# EAGLE design Encoder board Trim#1 (EAGLE 6.5.0)
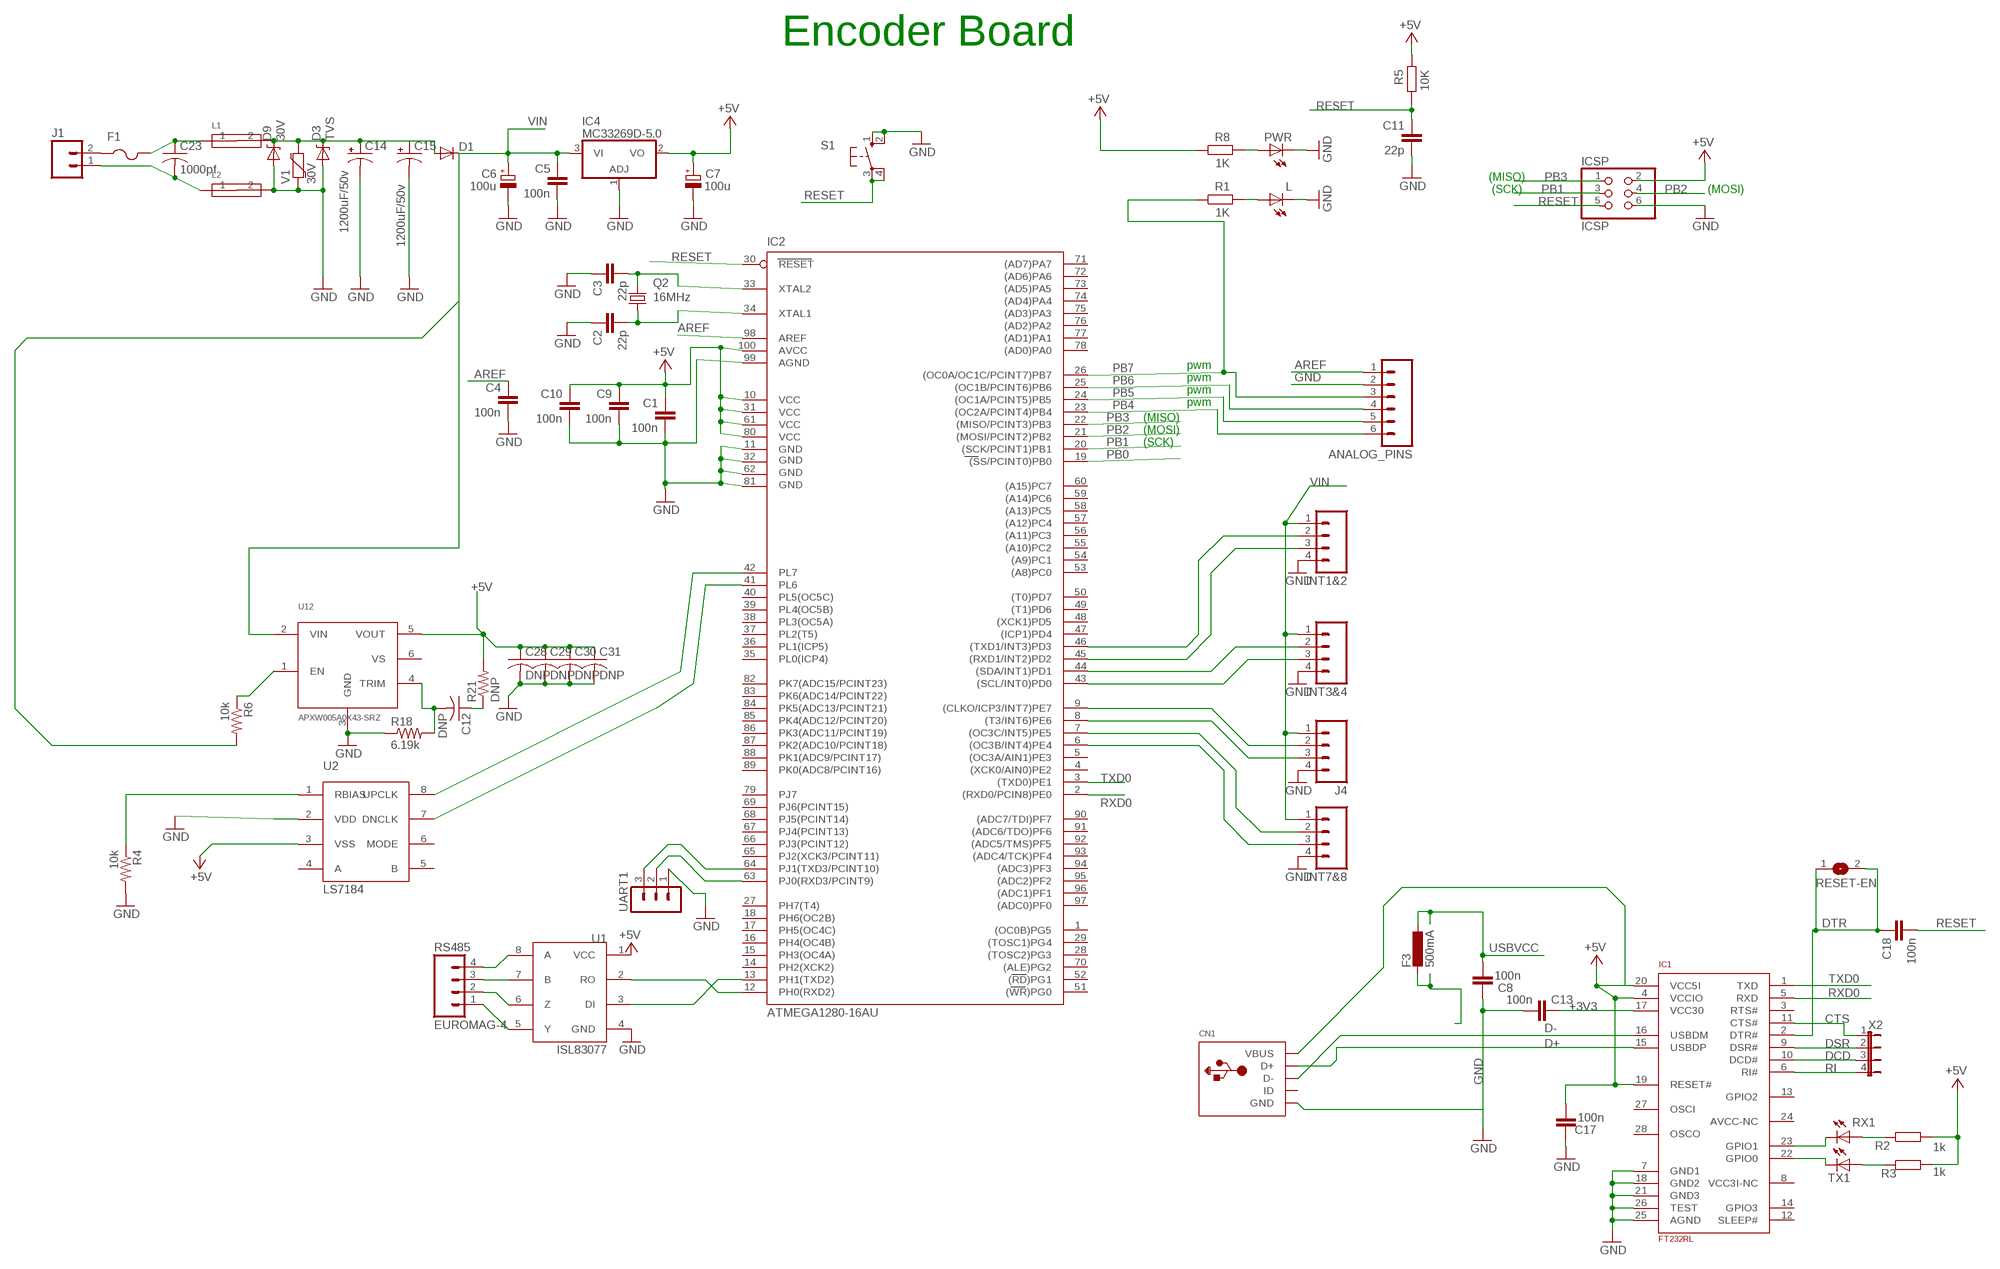
[diagram p0: schematic, sheet 1]

## Parts
ANALOG_PINS  M06  [06P]
C1  100n  C-EU  [C0805RND]
C2  22p  C-EU  [C0805RND]
C3  22p  C-EU  [C0805RND]
C4  100n  C-EU  [C0805RND]
C5  100n  C-EU  [C0805RND]
C6  100u  CPOL-EUSMCD  [SMC_D]
C7  100u  CPOL-EUSMCD  [SMC_D]
C8  100n  C-EU  [C0805RND]
C9  100n  C-EU  [C0805RND]
C10  100n  C-EU  [C0805RND]
C11  22p  C-EU  [C0805RND]
C12  DNP  C-USC0805  [C0805]
C13  100n  C-EU  [C0805RND]
C14  1200uF/50v  CAP_CAN1  [CAN_18MM]
C15  1200uF/50v  CAP_CAN1  [CAN_18MM]
C17  100n  C-EU  [C0805RND]
C18  100n  C-EU  [C0805RND]
C23  1000pf  C-USC1825  [C1825]
C28  DNP  C-USC0805  [C0805]
C29  DNP  C-USC0805  [C0805]
C30  DNP  C-USC0805  [C0805]
C31  DNP  C-USC0805  [C0805]
CN1  USBMINIB  [USB-MINIB]
D1  DIODE-SMB  [SMB]
D3  TVS  [DO-214AC]
D9  30V  DIODE-ZENERSMB  [SMB-DIODE]
F1  PTCFUSE-1206  [R1206]
F3  500mA  L-EUL1812  [L1812]
IC1  FT232RL  [SSOP28]
IC2  ATMEGA1280-16AU  [TQFP100]
IC4  MC33269D-5.0  [DPACK]
ICSP  ICSP  PINHD-2X3  [2X03]
INT1&2  EUROMAG-4  [M4]
INT3&4  EUROMAG-4UP  [M4-90]
INT7&8  EUROMAG-4UP  [M4-90]
J1  EUROMAG-290DEG  [M2]
J4  EUROMAG-4  [M4]
L  LED0805ROUND  [0805RND]
L1  FERITEBEAD  [0603]
L2  FERITEBEAD  [0603]
PWR  LED0805ROUND  [0805RND]
Q2  16MHz  CRYTALHC49S  [HC49/S]
R1  1K  R-EU_  [R0805RND]
R2  1k  R-EU_  [R0805RND]
R3  1k  R-EU_  [R0805RND]
R4  10k  R-US_R0805  [R0805]
R5  10K  R-EU_  [R0805RND]
R6  10k  R-US_R0805  [R0805]
R8  1K  R-EU_  [R0805RND]
R18  6.19k  R-US_R0805  [R0805]
R21  DNP  R-US_R0805  [R0805]
RESET-EN  SJ  [SJ]
RS485  EUROMAG-4  [M4]
RX1  LED0805ROUND  [0805RND]
S1  10-XX  [B3F-10XX]
TX1  LED0805ROUND  [0805RND]
U1  ISL83077  [SO08]
U2  LS7184  [SO08]
U12  APXW005A0X43-SRZ  [APXW005A0X43-SRZ]
UART1  MA03-1  [MA03-1]
V1  30V  VARISTOR-0603  [0603-RES]
X2  JP4E  [JP4]

## Nets
+3V3 [power]: C13.2 IC1.17(VCC30)
+5V [usbvcc]: C1.1 C7.+ C9.1 C10.1 C17.1 C28.1 C29.1 C30.1 C31.1 CN1.VBUS IC1.4(VCCIO) IC1.19(RESET#) IC1.20(VCC5I) IC2.10(VCC) IC2.31(VCC1) IC2.61(VCC2) IC2.80(VCC3) IC2.100(AVCC) IC4.2(VO) ICSP.2 R2.2 R3.2 R5.2 R8.1 R21.2 U1.1(VCC) U2.3(VSS) U12.5(VOUT)
AREF: ANALOG_PINS.1 C4.1 IC2.98(AREF)
CTS: IC1.11(CTS#) X2.1
D+: IC1.15(USBDP)
D-: CN1.D- IC1.16(USBDM)
DCD: IC1.10(DCD#) X2.3
DSR: IC1.9(DSR#) X2.2
DTR: C18.1 IC1.2(DTR#) RESET-EN.1 RESET-EN.2
GND [gnd]: ANALOG_PINS.2 C1.2 C2.1 C3.1 C4.2 C5.2 C6.- C7.- C8.2 C9.2 C10.2 C11.2 C13.1 C14.- C15.- C17.2 C28.2 C29.2 C30.2 C31.2 CN1.GND D3.A D9.A IC1.7(GND1) IC1.18(GND2) IC1.21(GND3) IC1.25(AGND) IC1.26(TEST) IC2.11(GND) IC2.32(GND1) IC2.62(GND2) IC2.81(GND3) IC2.99(AGND) IC4.1(ADJ) ICSP.6 INT1&2.4 INT3&4.4 INT7&8.4 J4.4 L2.2 L.P$2(C) PWR.P$2(C) R4.2 R18.1 S1.1(S) S1.2(S1) U1.4(GND) U2.2(VDD) U12.3(GND) UART1.1 V1.1
INT5&6: IC2.8((T3/INT6)PE6) J4.3
INT7&8: IC2.6((OC3B/INT4)PE4) INT7&8.3
N$1: IC2.46((TXD1/INT3)PD3) INT1&2.2
N$2: L.P$1(A) R1.2
N$3: PWR.P$1(A) R8.2
N$4: IC2.45((RXD1/INT2)PD2) INT1&2.3
N$5: IC2.44((SDA/INT1)PD1) INT3&4.2
N$6: C2.2 IC2.34(XTAL1) Q2.1
N$7: C3.2 IC2.33(XTAL2) Q2.2
N$8: IC2.43((SCL/INT0)PD0) INT3&4.3
N$9: IC2.9((CLKO/ICP3/INT7)PE7) J4.2
N$10: IC2.63(PJ0(RXD3/PCINT9)) UART1.2
N$11: R4.1 U2.1(RBIAS)
N$12: F1.1 J1.2
N$13: IC2.7((OC3C/INT5)PE5) INT7&8.2
N$14: IC2.64(PJ1(TXD3/PCINT10)) UART1.3
N$15: IC2.42(PL7) U2.8(UPCLK)
N$16: IC1.23(GPIO1) RX1.P$2(C)
N$17: IC2.13(PH1(TXD2)) U1.3(DI)
N$18: IC2.12(PH0(RXD2)) U1.2(RO)
N$19: RS485.4 U1.8(A)
N$20: RS485.3 U1.7(B)
N$21: IC1.22(GPIO0) TX1.P$2(C)
N$22: RS485.1 U1.5(Y)
N$23: R2.1 RX1.P$1(A)
N$24: R3.1 TX1.P$1(A)
N$25 [usbvcc]: F3.2
N$26: IC2.41(PL6) U2.7(DNCLK)
N$27: R6.1 U12.1(EN)
N$31: C23.2 J1.1 L2.1
N$41: C14.+ C15.+ D1.A D3.C D9.C L1.2 V1.2
N$45: C12.2 R18.2 U12.4(TRIM)
N$48: C12.1 R21.1
PB0: IC2.19((SS/PCINT0)PB0)
PB1: IC2.20((SCK/PCINT1)PB1) ICSP.3
PB2: IC2.21((MOSI/PCINT2)PB2) ICSP.4
PB3: IC2.22((MISO/PCINT3)PB3) ICSP.1
PB4: ANALOG_PINS.6 IC2.23((OC2A/PCINT4)PB4)
PB5: ANALOG_PINS.5 IC2.24((OC1A/PCINT5)PB5)
PB6: ANALOG_PINS.4 IC2.25((OC1B/PCINT6)PB6)
PB7: ANALOG_PINS.3 IC2.26((OC0A/OC1C/PCINT7)PB7) R1.1
RESET: C11.1 C18.2 IC2.30(RESET) ICSP.5 R5.1 S1.3(P) S1.4(P1)
RI: IC1.6(RI#) X2.4
RS485: RS485.2 U1.6(Z)
RXD0: IC1.5(RXD) IC2.2((RXD0/PCIN8)PE0)
TXD0: IC1.1(TXD) IC2.3((TXD0)PE1)
USBVCC [usbvcc]: C8.1 F3.1
VIN [power]: C5.1 C6.+ D1.C IC4.3(VI) INT1&2.1 INT3&4.1 INT7&8.1 J4.1 R6.2 U12.2(VIN)
VOL: C23.1 L1.1
Unconnected: CN1.D+ CN1.ID F1.2 IC1.3(RTS#) IC1.8(VCC3I-NC) IC1.12(SLEEP#) IC1.13(GPIO2) IC1.14(GPIO3) IC1.24(AVCC-NC) IC1.27(OSCI) IC1.28(OSCO) IC2.1((OC0B)PG5) IC2.4((XCK0/AIN0)PE2) IC2.5((OC3A/AIN1)PE3) IC2.14(PH2(XCK2)) IC2.15(PH3(OC4A)) IC2.16(PH4(OC4B)) IC2.17(PH5(OC4C)) IC2.18(PH6(OC2B)) IC2.27(PH7(T4)) IC2.28((TOSC2)PG3) IC2.29((TOSC1)PG4) IC2.35(PL0(ICP4)) IC2.36(PL1(ICP5)) IC2.37(PL2(T5)) IC2.38(PL3(OC5A)) IC2.39(PL4(OC5B)) IC2.40(PL5(OC5C)) IC2.47((ICP1)PD4) IC2.48((XCK1)PD5) IC2.49((T1)PD6) IC2.50((T0)PD7) IC2.51((WR)PG0) IC2.52((RD)PG1) IC2.53((A8)PC0) IC2.54((A9)PC1) IC2.55((A10)PC2) IC2.56((A11)PC3) IC2.57((A12)PC4) IC2.58((A13)PC5) IC2.59((A14)PC6) IC2.60((A15)PC7) IC2.65(PJ2(XCK3/PCINT11)) IC2.66(PJ3(PCINT12)) IC2.67(PJ4(PCINT13)) IC2.68(PJ5(PCINT14)) IC2.69(PJ6(PCINT15)) IC2.70((ALE)PG2) IC2.71((AD7)PA7) IC2.72((AD6)PA6) IC2.73((AD5)PA5) IC2.74((AD4)PA4) IC2.75((AD3)PA3) IC2.76((AD2)PA2) IC2.77((AD1)PA1) IC2.78((AD0)PA0) IC2.79(PJ7) IC2.82(PK7(ADC15/PCINT23)) IC2.83(PK6(ADC14/PCINT22)) IC2.84(PK5(ADC13/PCINT21)) IC2.85(PK4(ADC12/PCINT20)) IC2.86(PK3(ADC11/PCINT19)) IC2.87(PK2(ADC10/PCINT18)) IC2.88(PK1(ADC9/PCINT17)) IC2.89(PK0(ADC8/PCINT16)) IC2.90((ADC7/TDI)PF7) IC2.91((ADC6/TDO)PF6) IC2.92((ADC5/TMS)PF5) IC2.93((ADC4/TCK)PF4) IC2.94((ADC3)PF3) IC2.95((ADC2)PF2) IC2.96((ADC1)PF1) IC2.97((ADC0)PF0) U2.4(A) U2.5(B) U2.6(MODE) U12.6(VS)

## Notes on the sheet
- Encoder Board
- (MISO)
- (SCK) | (MOSI)
- pwm
- pwm
- pwm
- pwm
- (MISO)
- (MOSI)
- (SCK)

## Library data of the parts
ANALOG_PINS = con-amp-quick:M06: AMP QUICK CONNECTOR; OC_FARNELL: unknown; OC_NEWARK: unknown
C1-C5 C8-C11 C13 C17 C18 = rcl:C-EU: CAPACITOR, European symbol
C6 C7 = rcl:CPOL-EU: POLARIZED CAPACITOR, European symbol
C12 C23 C28-C31 = adafruit:C-US: CAPACITOR, American symbol
C14 C15 = NASA_LIB:CAP_CAN
CN1 = adafruit:USB: USB Connectors USBMINIB - Surface Mount Female Mini-B USB Connector 4UConnector: 06564 By microbuilder.eu Thru-hole RA Female Mini-B USB Connector 4UConnector: 18732 By ladyada.net
D1 = diode:DIODE-: DIODE
D3 = NASA_LIB:TVS
D9 = SparkFun:DIODE-ZENER: Zener Diode Production Part - 8199 3.4V Zener Voltage
F1 = adafruit:PTCFUSE: PTC fuses, resettable thermistors
F3 = rcl:L-EU: INDUCTOR, European symbol
IC1 = SmartPrj:FT232RL
IC2 = atmel-2005:ATMEGA*: MICROCONTROLLER 64/128/256 Kbytes FLASH 4 Kbytes EEPROM 8 Kbytes SRAM 86 General Purpose I/O pins 12-channels16-bit PWM 4 x Serial USARTs 16-channels 10-bit A/D
IC4 = linear:MC33269?*: Adjustable Output Low Dropout Voltage Regulator 800 mA Source: http://www.onsemi.com/pub/Collateral/MC33269-D.PDF
ICSP = pinhead:PINHD-2X3: PIN HEADER
INT1&2 INT3&4 INT7&8 J4 RS485 = NASA_LIB:EUROMAG-4
J1 = NASA_LIB:EUROMAG-2
L PWR RX1 TX1 = led:LED: LED OSRAM: - CHIPLED LG R971, LG N971, LY N971, LG Q971, LY Q971, LO R971, LY R971 LH N974, LH R974 LS Q976, LO Q976, LY Q976 LO Q996 - Hyper CHIPLED LW Q18S LB Q993, LB Q99A, LB R99A - SideLED LS A670, LO A670, LY A670, LG A670, LP A670 LB A673, LV A673, LT A673, LW A673 LH A674 LY A675 LS A676, LA A676, LO A676, LY A676, LW A676 LS A679, LY A679, LG A679 - Hyper Micro SIDELED® LS Y876, LA Y876, LO Y876, LY Y876 LT Y87S - SmartLED LW L88C, LW L88S LB L89C, LB L89S, LG L890 LS L89K, LO L89K, LY L89K LS L896, LA L896, LO L896, LY L896 - TOPLED LS T670, LO T670, LY T670, LG T670, LP T670 LSG T670, LSP T670, LSY T670, LOP T670, LYG T670 LG T671, LOG T671, LSG T671 LB T673, LV T673, LT T673, LW T673 LH T674 LS T676, LA T676, LO T676, LY T676, LB T676, LH T676, LSB T676, LW T676 LB T67C, LV T67C, LT T67C, LS T67K, LO T67K, LY T67K, LW E67C LS E67B, LA E67B, LO E67B, LY E67B, LB E67C, LV E67C, LT E67C LW T67C LS T679, LY T679, LG T679 LS T770, LO T770, LY T770, LG T770, LP T770 LB T773, LV T773, LT T773, LW T773 LH T774 LS E675, LA E675, LY E675, LS T675 LS T776, LA T776, LO T776, LY T776, LB T776 LHGB T686 LT T68C, LB T68C - Hyper Mini TOPLED® LB M676 - Mini TOPLED Santana® LG M470 LS M47K, LO M47K, LY M47K Source: http://www.osram.convergy.de/
L1 L2 = EmEndev:FERITEBEAD
Q2 = crystal:CRYTAL: CRYSTAL
R1-R3 R5 R8 = rcl:R-EU_: RESISTOR, European symbol
R4 R6 R18 R21 = adafruit:R-US_: RESISTOR, American symbol
RESET-EN = jumper:SJ: SMD solder JUMPER
S1 = switch-omron:10-XX: OMRON SWITCH
U1 = NASA_LIB:ISL83077
U2 = NASA_LIB:LS7184
U12 = NASA_LIB:APXW005A0X43-SRZ
UART1 = con-lstb:MA03-1: PIN HEADER; OC_FARNELL: unknown; OC_NEWARK: unknown
V1 = SparkFun:VARISTOR: Varistor Varistor (Variable resistor) is a nonlinear resistive element of the voltage dependence that resistance changes with applied voltage. Varistor is equivalent with Zener diode of two series connection.
X2 = jumper:JP4E: JUMPER

## Net classes
0 default: width 0.203 mm, drill 0.406 mm, clearance 0.203 mm
1 power: width 0.61 mm, drill 0.711 mm, clearance 0.203 mm
2 gnd: width 0.305 mm, drill 0.711 mm, clearance 0.203 mm
3 usbvcc: width 0.508 mm, drill 0.711 mm, clearance 0.203 mm

## Board
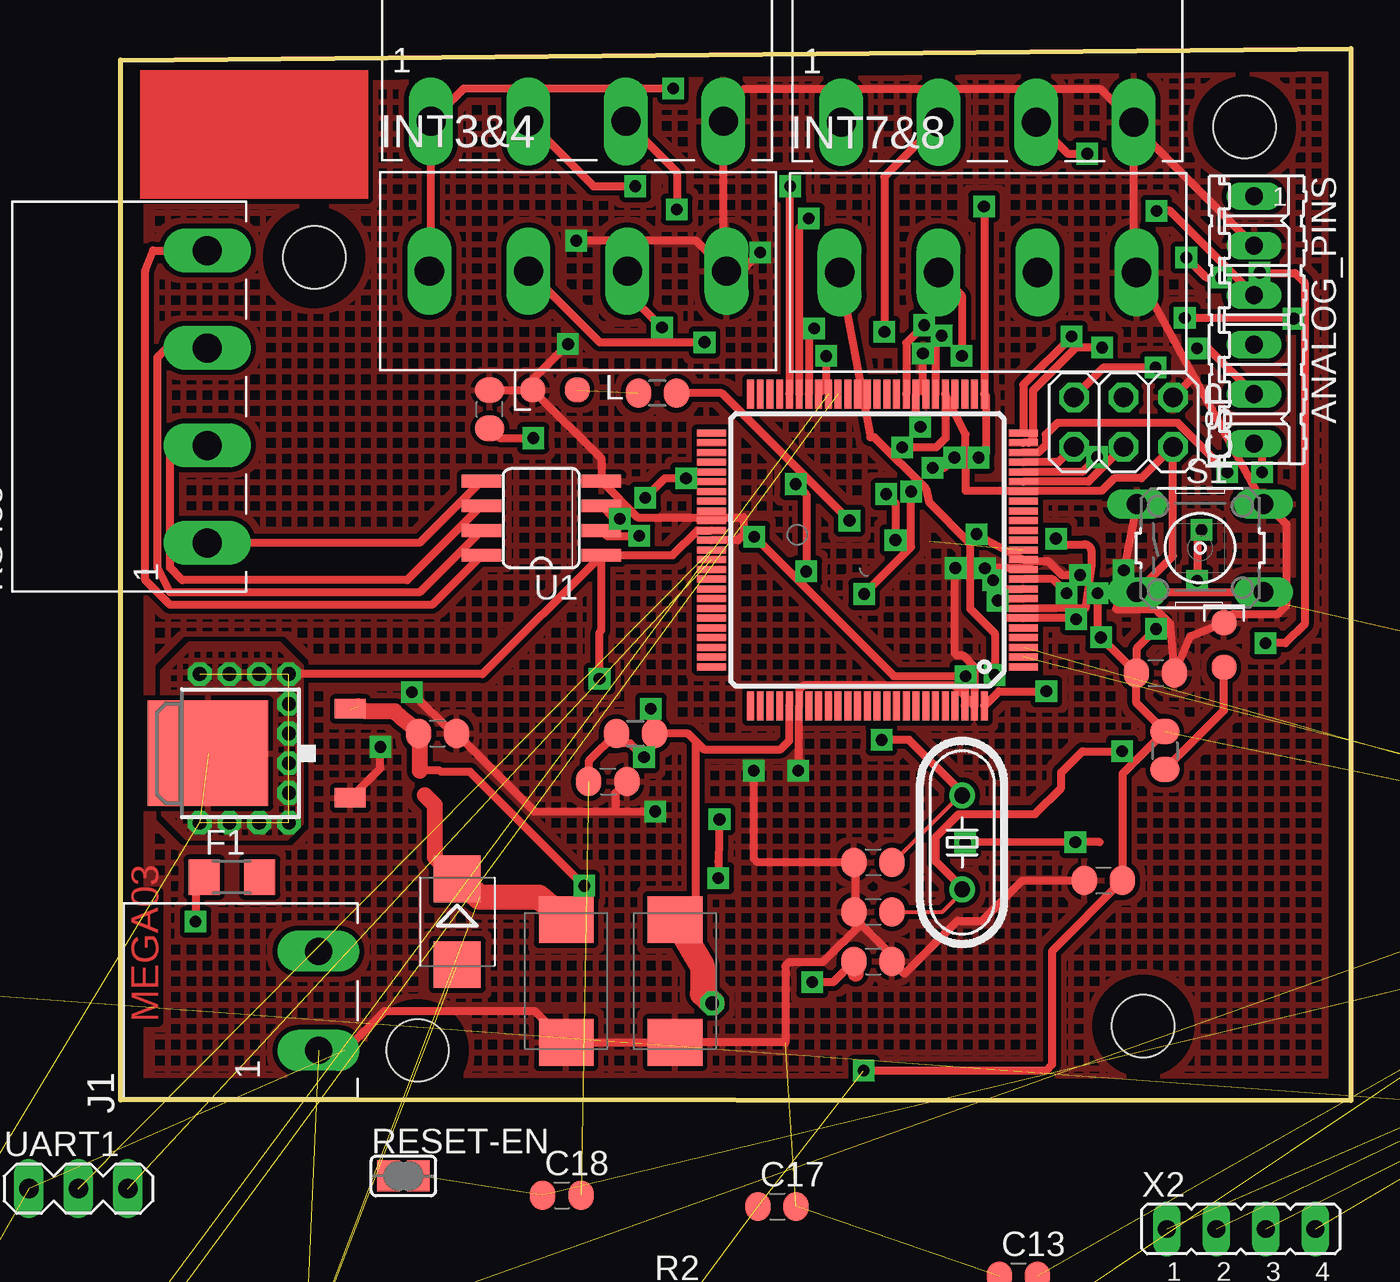
[diagram p1: board, top side]
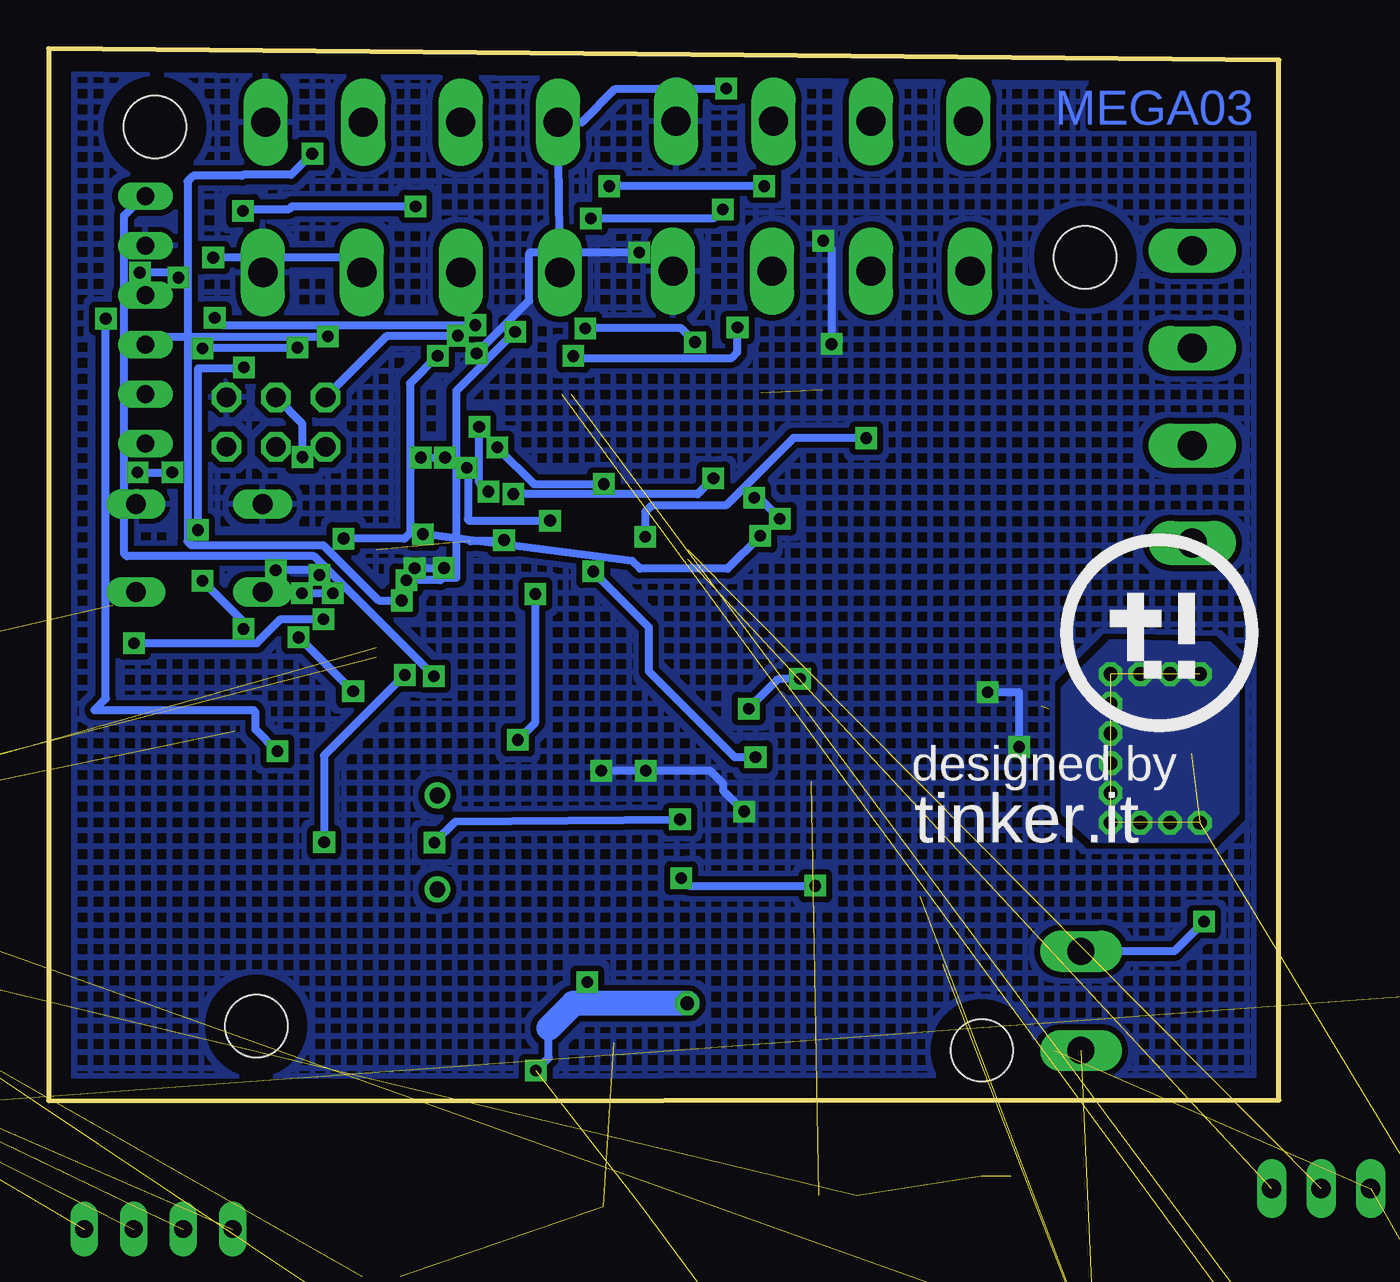
[diagram p2: board, bottom side, seen from below]

Size 63.11 x 53.98 mm. Coordinates in mm from the lower left corner, seen from the top.
Outline: 0,53.39 63.11,53.98 63.11,0 0,0.05 0,53.39
Copper layers (1*16): Top 0.035mm / dielectric 1.5mm / Bottom 0.035mm
Design rules "default": minimum track width 8mil, minimum drill 16mil, track to track 8mil, track to pad 8mil, pad to pad 8mil, via to via 10mil, smd to smd 8mil, copper to edge 40mil, drill to drill 12mil, minimum pad ring 10mil, minimum via ring 10mil, stop-mask expansion 4mil, vias tented up to drill 0mil, thermal gap 10mil
Holes 3.2 mm at 52.46,3.83 9.94,43.28 57.66,49.96 15.24,2.59

### Footprints (pad centres in the part's own frame; a part is rotated, then mirrored left to right if it is on the bottom)
06P = drill 0.914 long: 1 -6.35,0; 2 -3.81,0; 3 -1.27,0; 4 1.27,0; 5 3.81,0; 6 6.35,0
C0805RND = smd 1.3 x 1.5: 1 -0.977,0; 2 0.977,0
SMC_D = smd 2.4 x 2.8: + -3.15,0; - 3.15,0
C0805 = smd 1.3 x 1.5: 1 -0.85,0; 2 0.85,0
CAN_18MM = smd 8.8 x 9.6: + 7.05,0; - -7.05,0
C1825 = smd 1.9 x 6.8: 1 -1.95,0; 2 1.95,0
USB-MINIB = smd 0.5 x 2.308: D+ 0,4.064; D- -0.8,4.064; GND 1.6,4.064; ID 0.8,4.064; VBUS -1.6,4.064 | smd 2 x 2.4: GND1 -4.4,-2; GND2 -4.4,3.5; GND3 4.4,3.5; GND4 4.4,-2 | hole 1: -2.2,1; 2.2,1
SMB = smd 2.4 x 2.4: A 2.2,0; C -2.2,0
DO-214AC = smd 1.8 x 1.7: A 2.05,0; C -2.05,0
SMB-DIODE = smd 2.4 x 2.4: A 2.2,0; C -2.2,0
R1206 = smd 1.6 x 1.803: 1 -1.422,0; 2 1.422,0
L1812 = smd 1.9 x 3.4: 1 -1.95,0; 2 1.95,0
SSOP28 = smd 0.381 x 1.499: 1 -4.225,-3.625; 2 -3.575,-3.625; 3 -2.925,-3.625; 4 -2.275,-3.625; 5 -1.625,-3.625; 6 -0.975,-3.625; 7 -0.325,-3.625; 8 0.325,-3.625; 9 0.975,-3.625; 10 1.625,-3.625; 11 2.275,-3.625; 12 2.925,-3.625; 13 3.575,-3.625; 14 4.225,-3.625; 15 4.225,3.625; 16 3.575,3.625; 17 2.925,3.625; 18 2.275,3.625; 19 1.625,3.625; 20 0.975,3.625; 21 0.325,3.625; 22 -0.325,3.625; 23 -0.975,3.625; 24 -1.625,3.625; 25 -2.275,3.625; 26 -2.925,3.625; 27 -3.575,3.625; 28 -4.225,3.625
TQFP100 = smd 1.5 x 0.35: 1 -8,6; 2 -8,5.5; 3 -8,5; 4 -8,4.5; 5 -8,4; 6 -8,3.5; 7 -8,3; 8 -8,2.5; 9 -8,2; 10 -8,1.5; 11 -8,1; 12 -8,0.5; 13 -8,0; 14 -8,-0.5; 15 -8,-1; 16 -8,-1.5; 17 -8,-2; 18 -8,-2.5; 19 -8,-3; 20 -8,-3.5; 21 -8,-4; 22 -8,-4.5; 23 -8,-5; 24 -8,-5.5; 25 -8,-6; 51 8,-6; 52 8,-5.5; 53 8,-5; 54 8,-4.5; 55 8,-4; 56 8,-3.5; 57 8,-3; 58 8,-2.5; 59 8,-2; 60 8,-1.5; 61 8,-1; 62 8,-0.5; 63 8,0; 64 8,0.5; 65 8,1; 66 8,1.5; 67 8,2; 68 8,2.5; 69 8,3; 70 8,3.5; 71 8,4; 72 8,4.5; 73 8,5; 74 8,5.5; 75 8,6 | smd 0.35 x 1.5: 26 -6,-8; 27 -5.5,-8; 28 -5,-8; 29 -4.5,-8; 30 -4,-8; 31 -3.5,-8; 32 -3,-8; 33 -2.5,-8; 34 -2,-8; 35 -1.5,-8; 36 -1,-8; 37 -0.5,-8; 38 0,-8; 39 0.5,-8; 40 1,-8; 41 1.5,-8; 42 2,-8; 43 2.5,-8; 44 3,-8; 45 3.5,-8; 46 4,-8; 47 4.5,-8; 48 5,-8; 49 5.5,-8; 50 6,-8; 76 6,8; 77 5.5,8; 78 5,8; 79 4.5,8; 80 4,8; 81 3.5,8; 82 3,8; 83 2.5,8; 84 2,8; 85 1.5,8; 86 1,8; 87 0.5,8; 88 0,8; 89 -0.5,8; 90 -1,8; 91 -1.5,8; 92 -2,8; 93 -2.5,8; 94 -3,8; 95 -3.5,8; 96 -4,8; 97 -4.5,8; 98 -5,8; 99 -5.5,8; 100 -6,8
DPACK = smd 1 x 1.6: 1 -2.28,-4.8; 3 2.28,-4.8 | smd 5.4 x 6.2: 2 0,2.5
2X03 = drill 1.016 octagon: 1 -2.54,-1.27; 2 -2.54,1.27; 3 0,-1.27; 4 0,1.27; 5 2.54,-1.27; 6 2.54,1.27
M4 = drill 1.5 long: 1 0,0; 2 5,0; 3 10,0; 4 15,0
M4-90 = drill 1.5 long: 1 0,0; 2 5.08,0; 3 10.16,0; 4 15.24,0
M2 = drill 1.4 long: 1 -2.54,0; 2 2.54,0
0805RND = smd 1.27 x 1.27: P$1 -1.143,0; P$2 1.143,0
0603 = smd 1.1 x 1: 1 -0.85,0; 2 0.85,0
HC49/S = drill 0.813: 1 -2.413,0; 2 2.413,0
R0805RND = smd 1.3 x 1.5: 1 -0.977,0; 2 0.977,0
R0805 = smd 1.1 x 1.4: 1 -1,0; 2 1,0
SJ = smd 1.168 x 1.6: 1 -0.762,0; 2 0.762,0
B3F-10XX = drill 1.016 long: 1 -3.251,2.261; 2 3.251,2.261; 3 -3.251,-2.261; 4 3.251,-2.261
SO08 = smd 0.66 x 2.032: 1 -1.905,-3.073; 2 -0.635,-3.073; 3 0.635,-3.073; 4 1.905,-3.073; 5 1.905,3.073; 6 0.635,3.073; 7 -0.635,3.073; 8 -1.905,3.073
APXW005A0X43-SRZ = smd 1.73 x 2.44: 1 1.28,1.52 | smd 2.44 x 1.73: 2 18.796,1.27; 3 13.92,10.16; 4 9.906,10.16; 5 5.842,10.16; 6 1.574,10.16
MA03-1 = drill 1.016 long: 1 -2.54,0; 2 0,0; 3 2.54,0
0603-RES = smd 1.1 x 1: 1 -0.85,0; 2 0.85,0
JP4 = drill 0.914 long: 1 -3.81,0; 2 -1.27,0; 3 1.27,0; 4 3.81,0

### Placement (x,y rotation side)
ANALOG_PINS  58.16,40.06 270 top
C1  50.43,11.3 180 top
C2  38.61,9.7 0 top
C3  38.61,12.24 0 top
C4  18.94,35.48 90 top
C5  16.26,18.84 0 top
C6  22.86,6.14 270 top
C7  28.45,6.14 270 top
C8  101.82,-2.55 0 top  (outside the outline)
C9  53.09,21.95 0 top
C10  38.61,7.16 0 top
C11  25,16.38 0 top
C12  -7.83,-49.46 0 top  (outside the outline)
C13  46.06,-9 0 top  (outside the outline)
C14  -19.18,-69.16 0 top  (outside the outline)
C15  -19.18,-92.23 0 top  (outside the outline)
C17  33.68,-5.43 0 top  (outside the outline)
C18  22.64,-4.85 0 top  (outside the outline)
C23  3.19,-109.26 0 top  (outside the outline)
C28  -2.79,-49.46 0 top  (outside the outline)
C29  -19.73,-54.96 0 top  (outside the outline)
C30  -14.69,-54.96 0 top  (outside the outline)
C31  -9.65,-54.96 0 top  (outside the outline)
CN1  -16.17,-25.88 0 top  (outside the outline)
D1  17.27,9.19 270 top
D3  -19.64,-123.62 0 top  (outside the outline)
D9  -26.79,-124.49 0 top  (outside the outline)
F1  5.71,11.48 0 top
F3  -13.15,5.99 0 top  (outside the outline)
IC1  92.62,14.94 0 top  (outside the outline)
IC2  38.31,28.26 180 top
IC4  6.99,17.83 90 top
ICSP  51.46,34.82 0 top
INT1&2  15.93,50.25 0 top
INT3&4  15.85,42.56 0 top
INT7&8  36.89,42.5 0 top
J1  10.16,5.13 90 top
J4  36.98,50.21 0 top
L  22.28,36.47 180 top
L1  -11.88,-121.94 0 top  (outside the outline)
L2  -8.78,-121.94 0 top  (outside the outline)
PWR  56.61,23.38 90 top
Q2  43.18,13.25 90 top
R1  27.54,36.3 180 top
R2  28.15,-10.23 0 top  (outside the outline)
R3  98.96,-11.3 0 top  (outside the outline)
R4  -28.79,-131.14 0 top  (outside the outline)
R5  26.42,18.84 0 top
R6  -28.79,-136.64 0 top  (outside the outline)
R8  53.57,17.96 270 top
R18  -19.73,-49.46 0 top  (outside the outline)
R21  -13,-49.46 0 top  (outside the outline)
RESET-EN  14.52,-3.85 0 top  (outside the outline)
RS485  4.45,28.62 90 top
RX1  36.21,-17.76 0 top  (outside the outline)
S1  55.39,28.36 0 top
TX1  87.03,29.47 0 top  (outside the outline)
U1  21.59,29.89 90 top
U2  -26.17,-53.51 0 top  (outside the outline)
U12  -20.71,-44.24 0 top  (outside the outline)
UART1  -2.16,-4.51 0 top  (outside the outline)
V1  -14.99,-121.94 0 top  (outside the outline)
X2  57.48,-6.58 0 top  (outside the outline)

### Tracks (layer width: path | path; a pad name or v marks a point on that pad's centre or on a via)
+3V3  (1 unrouted)
+5V  (via drill 0.6, 0.71)  (26 unrouted)
  Top 0.406: U1.1 18.57,21.89 v8.64,21.89 | C7.+ 29.54,10.38 29.54,18.43 | 29.54,18.43 29.12,18.84 R5.2 27.21,19.03 v27.21,20.12 | v24.57,21.66 24.57,24.05 24.66,24.14 U1.1 | v38.12,1.54 47.47,1.54 47.78,1.86 47.78,7.68 C1.1 51.41,16.77 R8.1 52.12,20.4 C9.1 | C10.1 36.55,6.08 v35.48,6.08 | 29.54,18.43 29.93,18.04 33.87,18.04 34.31,18.48 IC2.80 | U1.1 24.67,27.99 28.32,27.99 29.59,29.26 IC2.61 | C9.1 v50.3,23.77 50.13,23.94 v50.13,26.04 | v48.54,26.04 47.82,26.76 IC2.10 | v42.13,39.26 41.81,38.94 IC2.31 | IC2.100 45.06,21 v47.5,21 | ICSP.2 50.45,37.63 v53.11,37.63 | v55.46,29.29 55.23,29.06 v55.23,26.68 | v53.12,24.21 52.12,23.2 C9.1
  Top 0.813: 37.72,6.52 C10.1
  Top 1.27: v30.35,5 29.84,5.51 29.84,6.9 C7.+
  Bottom 0.406: v27.21,20.12 25.67,21.66 v24.57,21.66 | v38.12,1.54 37.47,2.2 37.47,3.73 | v35.48,6.08 35.28,5.88 35.28,5 | v50.13,26.04 v48.54,26.04 | ICSP.2 45.75,39.26 v42.13,39.26 | v47.5,21 50.27,23.77 v50.3,23.77 | v53.11,37.63 53.16,37.57 55.44,37.57 55.46,37.56 v55.46,29.29 | v55.23,26.68 53.12,24.57 v53.12,24.21
  Bottom 1.27: 37.47,3.73 36.2,5 35.28,5 v30.35,5
  other vias: 4.06,21.89 7.11,21.89 5.59,21.89 8.64,20.37 8.64,18.84 4.06,14.27 5.59,14.27 7.11,14.27 8.64,15.79 8.64,17.32 8.64,14.27
  pour Top (isolate 0.305, hatched): 8.51,13.51 9.27,14.27 9.27,22.27 8.13,23.41 3.56,23.41 2.16,22.02 2.16,14.78 3.43,13.51
  pour Bottom: 2.16,14.78 2.16,22.02 3.56,23.41 8.64,23.54 11.05,21.13 11.05,14.78 9.53,13.38 3.56,13.38
AREF  (via drill 0.6)
  Top 0.406: C4.1 19.44,34 v21.17,34 | v32.51,28.94 39.66,21.78 v43.35,21.78 43.31,21.75 IC2.98
  Bottom 0.406: v21.17,34 24.92,34 28.37,30.55 32.18,30.55 32.51,30.21 v32.51,28.94 | v43.35,21.78 49.51,27.94 59.11,27.94 59.25,28.08 59.25,45.42 58.26,46.41 ANALOG_PINS.1
CTS  (1 unrouted)
D-  (1 unrouted)
DCD  (1 unrouted)
DSR  (1 unrouted)
DTR  (3 unrouted)
GND  (via drill 0.6)  (24 unrouted)
  Top 0.305: 11.81,15.54 IC4.1 | C2.1 37.72,10.33 | 37.72,11.6 C3.1 | C10.2 39.24,7.79
  Top 0.406: 37.72,10.33 37.72,11.6 | 39.24,7.79 37.97,9.06 | 37.97,9.06 C2.1 | C10.2 40.23,6.52 42.94,9.23 44.2,9.23 46.27,11.3 C1.2 | 37.97,9.06 36.02,7.11 34.3,7.11 34.1,6.91 34.1,2.96 34.08,2.99 C7.- C6.- 21.26,4.59 13.54,4.59 11.53,2.59 | 11.81,15.54 13.32,17.05 v13.32,18.15 | v14.94,20.96 17.05,18.84 C5.2 21.23,14.84 25.39,14.84 | 25.39,14.84 v27.44,14.84 27.39,14.89 | C11.2 25.39,15.8 25.39,14.84 | v34.77,16.93 34.81,16.97 IC2.81 34.81,21.07 35.04,21.3 42.78,21.3 IC2.99 43.81,22.26 43.21,22.87 42.9,22.87 42.79,22.98 42.79,27.29 v42.84,27.33 | C3.1 32.68,12.24 32.49,12.43 v32.49,16.93 | 30.93,42.72 INT3&4.4 31.85,42.56 v32.82,43.53 | 30.93,42.72 INT1&2.4 30.93,50.88 31.95,51.89 50.3,51.89 J4.4 | J4.4 51.98,42.65 INT7&8.4 52.15,42.48 55.14,37.01 | 55.14,37.01 S1.2 58.78,30.62 59.82,29.58 59.82,25.44 59.36,24.98 57.07,24.98 PWR.P$2 54.86,23.83 C9.2 53.84,24.48 53.09,25.23 51.08,25.23 v51.47,27.22 | 30.93,42.72 29.52,44.13 v23.38,44.13 | v22.95,38.82 21.14,37.01 L.P$2 | C4.2 18.96,36.47 L.P$2 | L.P$2 24.66,32.95 U1.4 26.52,29.93 31.97,29.93 31.97,29.05 31.68,28.76 IC2.62 | S1.1 v51.47,27.22 | ANALOG_PINS.2 51.98,50.05 J4.4 | v49.22,26.98 48.29,26.98 47.58,27.69 46.74,27.69 IC2.11 46.25,27.32 v44.34,27.32 | v51.47,27.22 51.43,27.18 51.43,27.01 | ICSP.6 54.91,37.01 55.14,37.01 | IC2.32 41.16,36.41 v41.16,38.35
  Bottom 0.406: v13.32,18.15 13.32,20.96 v14.94,20.96 | v27.44,14.84 28.5,15.9 28.5,16.26 29.18,16.93 v32.49,16.93 v34.77,16.93 | v23.38,44.13 22.95,43.7 v22.95,38.82 | v49.22,26.98 49.47,27.22 v51.47,27.22 | v44.34,27.32 v44.33,27.33 v42.84,27.33 | v41.16,38.35 38.47,41.04 38.47,43.47 38.41,43.53 v32.82,43.53
  pour Top (isolate 0.254, rank 2, hatched): 0.64,52.75 63.01,53.34 63.01,1.27 0.64,0.68
  pour Bottom (isolate 0.305, rank 2, hatched): 0.64,52.75 62.96,53.14 62.96,1.07 1.27,0.68 0.64,1.32
INT5&6  (via drill 0.6)
  Top 0.406: J4.3 48.6,48.59 v49.6,48.59 | v45.01,25.67 45.1,25.76 IC2.8
  Bottom 0.406: v49.6,48.59 50.69,47.5 53.15,47.5 53.19,47.45 55.7,47.45 55.99,47.17 55.99,28.7 55.8,28.51 49.03,28.51 46.19,25.67 v45.01,25.67
INT7&8  (via drill 0.6)
  Top 0.406: 45.44,24.78 46.3,24.78 IC2.6 48.97,24.76 v49.02,24.71 | v54.68,43.26 55.7,42.23 v56.46,42.23 | v58.44,42.49 58.47,42.46 60.27,42.46 60.75,41.98 60.75,24.46 59.77,23.48 v58.74,23.48
  Bottom 0.406: INT7&8.3 47.81,43.26 v54.68,43.26 | v56.46,42.23 56.71,42.49 v58.44,42.49 | v58.74,23.48 52.44,23.48 51.21,24.71 v49.02,24.71
N$1  (via drill 0.6)
  Top 0.406: INT1&2.2 24.26,46.92 v26.41,46.92 | v34.36,46.92 34.31,46.88 IC2.46
  Bottom 0.406: v26.41,46.92 v34.36,46.92
N$2  (1 unrouted)
N$3
  Top 0.406: R8.2 56.61,20.02 PWR.P$1
N$4  (via drill 0.6)
  Top 0.406: INT1&2.3 28.54,47.65 v28.54,45.74 | v35.3,45.26 34.81,44.77 IC2.45
  Bottom 0.406: v28.54,45.74 29.01,45.26 v35.3,45.26
N$5  (via drill 0.6)
  Top 0.406: INT3&4.2 24.57,38.92 v29.96,38.92 | v35.59,39.63 35.31,39.35 IC2.44
  Bottom 0.406: v29.96,38.92 30.67,39.63 v35.59,39.63
N$6  (via drill 0.6)
  Top 0.203: Q2.1 43.26,10.84 43.28,10.82 42.16,9.7 C2.2
  Top 0.406: 43.26,10.84 41.82,12.27 41.82,13.53 43.01,14.71 46.91,14.71 48.26,16.06 48.26,16.85 49.35,17.93 v51.38,17.93 | v60.19,40.13 60.16,40.16 v54.6,40.16 | v41.23,39.8 40.31,38.88 IC2.34
  Bottom 0.406: v51.38,17.93 52.5,19.05 52.5,19.94 52.6,20.04 60.78,20.04 60.19,20.63 v60.19,40.13 | v54.6,40.16 54.24,39.8 v41.23,39.8
N$7  (via drill 0.6)
  Top 0.203: Q2.2 43.18,15.79 39.62,12.24 C3.2
  Top 0.406: 43.18,15.79 40.46,18.52 v39.04,18.52 | v38.15,26 40.56,28.41 v40.56,31.26 | v41.03,34.57 40.81,34.79 IC2.33
  Bottom 0.406: v39.04,18.52 38.15,19.42 v38.15,26 | v40.56,31.26 41.03,31.73 v41.03,34.57
N$8  (via drill 0.6)
  Top 0.406: IC2.43 36.2,36.65 v36.2,38.21 | v27.78,39.68 26.01,41.45 INT3&4.3
  Bottom 0.406: v36.2,38.21 36.11,38.11 28.06,38.11 27.78,38.4 v27.78,39.68
N$9  (via drill 0.6)
  Top 0.406: J4.2 39.19,47.41 v39.19,39.45 | v44.77,26.71 45.22,26.26 IC2.9
  Bottom 0.406: v39.19,39.45 42.22,36.42 42.22,28.27 42.21,26.83 42.92,26.8 43.02,26.71 v44.77,26.71
N$10  (1 unrouted)
N$11  (1 unrouted)
N$12  (via drill 0.6)
  Top 0.406: F1.1 3.85,11.03 v3.85,9.19
  Bottom 0.406: v3.85,9.19 5.37,7.67 J1.2
N$13  (via drill 0.6)
  Top 0.406: INT7&8.2 43.16,41.31 v43.16,38.22 | v47.99,28.84 48.3,28.53 arc-90 48.33,28.55 49.45,28.55 arc-90 49.81,28.18 49.81,27.45 49.51,25.27 47.96,25.26 IC2.7
  Bottom 0.406: v43.16,38.22 44.58,36.8 44.58,29.13 44.87,28.84 v47.99,28.84
N$14  (1 unrouted)
N$15  (1 unrouted)
N$16  (1 unrouted)
N$17  (via drill 0.6)  (1 unrouted)
  Top 0.406: U1.3 25.33,29.86 v25.61,29.86 | v26.92,30.94 27.92,31.94 v29.02,31.94 | v39.29,31.13 39.76,30.66 v39.76,28.76
  Bottom 0.406: v25.61,29.86 26.69,30.94 v26.92,30.94 | v29.02,31.94 29.82,31.13 v39.29,31.13 | v39.76,28.76 39.81,28.71 41.49,28.71
N$18  (via drill 0.6)
  Top 0.406: U1.2 24.94,28.98 v26.61,28.98 | v43.92,29.07 44.24,28.87 IC2.12
  Bottom 0.406: v26.61,28.98 28.29,27.3 32.79,27.3 33.18,27.7 v43.92,29.07
N$19
  Top 0.406: U1.8 15.98,25.45 2.54,25.45 1.27,26.72 1.27,42.59 1.67,43.62 RS485.4
N$20
  Top 0.406: U1.7 15.34,26.08 2.54,26.08 1.91,27.35 1.91,38.15 2.38,38.62 RS485.3
N$21  (1 unrouted)
N$22
  Top 0.406: U1.5 15.34,28.62 RS485.1
N$23  (1 unrouted)
N$24  (1 unrouted)
N$26  (1 unrouted)
N$27  (1 unrouted)
N$31  (2 unrouted)
N$41  (6 unrouted)
N$45  (2 unrouted)
N$48  (1 unrouted)
PB1
  Top 0.406: ICSP.3 49.66,31.76 IC2.20
PB2  (via drill 0.6)
  Top 0.406: v50.1,33.02 49.34,32.26 IC2.21
  Bottom 0.406: ICSP.4 50.1,34.74 v50.1,33.02
PB3
  Top 0.406: ICSP.1 48.12,32.76 IC2.22
PB4  (via drill 0.6)
  Top 0.406: ANALOG_PINS.6 58.56,33.31 v58.56,32.24 | v56.78,32.24 54.24,34.77 48.06,34.77 47.47,34.18 47.47,33.63 47.1,33.26 IC2.23
  Bottom 0.406: v58.56,32.24 v56.78,32.24
PB5  (via drill 0.6)
  Top 0.406: ANALOG_PINS.5 55.81,38.6 v55.23,38.6 | v50.35,38.64 49.01,38.64 46.81,36.44 46.81,33.97 46.59,33.76 IC2.24
  Bottom 0.406: v55.23,38.6 55.18,38.64 v50.35,38.64
PB6  (via drill 0.6)
  Top 0.406: v48.79,39.21 46.31,36.73 IC2.25
  Bottom 0.406: ANALOG_PINS.4 57.73,39.21 v48.79,39.21
PB7  (via drill 0.6)
  Top 0.406: ANALOG_PINS.3 53.83,45.65 v53.15,45.65 | v44.3,45.89 44.31,45.87 IC2.26 44.38,36.19 44.38,33.19 44.19,33 v44.03,33 | v42.78,33 42.26,32.47 v41.67,32.47 | v37.39,29.77 30.85,36.31 R1.1
  Bottom 0.406: v53.15,45.65 53.05,45.75 50.78,45.75 50.64,45.89 v44.3,45.89 | v44.03,33 v42.78,33 | v41.67,32.47 41.61,32.41 41.61,29.83 41.54,29.77 v37.39,29.77
RESET  (via drill 0.6)  (1 unrouted)
  Top 0.203: 25.53,18.21 25.51,18.34 R5.1
  Top 0.406: R5.1 24.02,17.42 C11.1 | S1.4 S1.3 53.99,27.96 ICSP.5 52.38,31.94 50.99,31.94 50.33,31.28 43.37,31.28 43.34,34.18 IC2.30 42.32,34 41.84,33.52 v40.1,33.52 | v34.63,31.64 35.18,31.09 v35.18,27.16 | v26.86,17.63 26.15,18.34 25.51,18.34
  Bottom 0.406: v40.1,33.52 38.2,31.62 38.18,31.64 v34.63,31.64 | v35.18,27.16 32.33,24.31 32.33,22.04 27.92,17.63 v26.86,17.63
RI  (1 unrouted)
RS485
  Top 0.406: U1.6 14.71,26.72 3.17,26.72 2.54,27.35 2.54,33.07 2.46,33.62 RS485.2
RXD0  (1 unrouted)
TXD0  (1 unrouted)
USBVCC  (1 unrouted)
VIN  (via drill 0.6)  (3 unrouted)
  Top 0.406: C6.+ 23.79,10.22 v23.79,11.03 17.93,16.88 16.43,16.88 16.37,16.94 15.37,16.94 | INT7&8.1 38.47,34.04 38.68,34.04 41.32,31.4 41.47,30.71 43.58,28.6 43.58,25.24 44.84,23.98 v44.84,21.85 | 50.24,13.28 49.09,13.27 | 49.09,13.27 v48.99,13.27 | v48.99,13.27 v43.33,13.24 | v30.73,14.44 30.67,12.28 v30.67,11.42 | v28.35,51.94 17.62,51.94 INT1&2.1 15.93,42.65 INT3&4.1 | v48.99,13.27 | v48.99,13.27 49.09,13.27
  Top 0.61: 11.81,20.11 IC4.3 | 15.37,18.21 C5.1 | 15.24,18.84 15.11,19.1
  Top 0.813: 15.37,16.94 15.37,18.21 | 15.11,19.1 14.45,19.6 14.07,19.98 12.57,19.98 12.19,20.24 | C5.1 15.24,18.84 | 15.62,15.67 16.13,15.16 16.13,12.49 D1.C
  Top 1.27: D1.C 18.41,10.46 21.46,10.46 C6.+
  Bottom 0.406: INT7&8.1 J4.1 35.76,50.21 34.08,51.89 28.4,51.89 v28.35,51.94 | v43.33,13.24 42.25,14.32 v30.73,14.44 | v30.67,11.42 30.27,11.03 v23.79,11.03 | v44.84,21.85 48.99,17.7 v48.99,13.27
VOL  (1 unrouted)
(copper drawn outside any net)
  shapes: Top area x1

### Text on the board
Top: MEGA03
Bottom: MEGA03
bNames: designed by | tinker.it
Reference: C7 | C6